# Altium schematic sheet wlpkt1_cpu.SchDoc: Moduł mikrokontrolera
size A4; DocumentNumber: 3; SheetNumber: 3; SheetTotal: 5
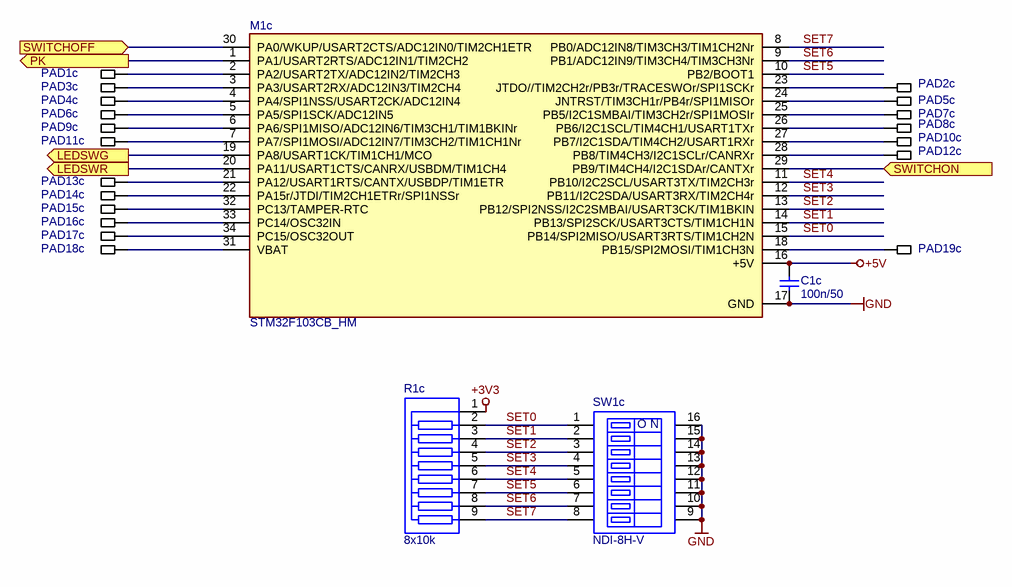
[diagram p0: wlpkt1_cpu.SchDoc]

## Parts
C1c  100n/50  [0805]
M1c  STM32F103CB_HM  [STM32F103CB_HM]
PAD1c  PAD0_6MM  [PAD0_6MM]  (value not drawn)  (no BOM)
PAD2c  PAD0_6MM  [PAD0_6MM]  (value not drawn)  (no BOM)
PAD3c  PAD0_6MM  [PAD0_6MM]  (value not drawn)  (no BOM)
PAD4c  PAD0_6MM  [PAD0_6MM]  (value not drawn)  (no BOM)
PAD5c  PAD0_6MM  [PAD0_6MM]  (value not drawn)  (no BOM)
PAD6c  PAD0_6MM  [PAD0_6MM]  (value not drawn)  (no BOM)
PAD7c  PAD0_6MM  [PAD0_6MM]  (value not drawn)  (no BOM)
PAD8c  PAD0_6MM  [PAD0_6MM]  (value not drawn)  (no BOM)
PAD9c  PAD0_6MM  [PAD0_6MM]  (value not drawn)  (no BOM)
PAD10c  PAD0_6MM  [PAD0_6MM]  (value not drawn)  (no BOM)
PAD11c  PAD0_6MM  [PAD0_6MM]  (value not drawn)  (no BOM)
PAD12c  PAD0_6MM  [PAD0_6MM]  (value not drawn)  (no BOM)
PAD13c  PAD0_6MM  [PAD0_6MM]  (value not drawn)  (no BOM)
PAD14c  PAD0_6MM  [PAD0_6MM]  (value not drawn)  (no BOM)
PAD15c  PAD0_6MM  [PAD0_6MM]  (value not drawn)  (no BOM)
PAD16c  PAD0_6MM  [PAD0_6MM]  (value not drawn)  (no BOM)
PAD17c  PAD0_6MM  [PAD0_6MM]  (value not drawn)  (no BOM)
PAD18c  PAD0_6MM  [PAD0_6MM]  (value not drawn)  (no BOM)
PAD19c  PAD0_6MM  [PAD0_6MM]  (value not drawn)  (no BOM)
R1c  8x10k  [9SIP100]
SW1c  NDI-8H-V  [EAH108E]

## Ports
LEDSWG (out), LEDSWR (out), PK (out), SWITCHOFF (in), SWITCHON (in)

## Nets
+3V3: R1c.1
+5V: C1c.1 M1c.16(+5V)
GND: C1c.2 M1c.17(GND) SW1c.9 SW1c.10 SW1c.11 SW1c.12 SW1c.13 SW1c.14 SW1c.15 SW1c.16
LEDSWG: M1c.19(PA8/USART1CK/TIM1CH1/MCO) ; port LEDSWG
LEDSWR: M1c.20(PA11/USART1CTS/CANRX/USBDM/TIM1CH4) ; port LEDSWR
PK: M1c.1(PA1/USART2RTS/ADC12IN1/TIM2CH2) ; port PK
SET0: M1c.15(PB14/SPI2MISO/USART3RTS/TIM1CH2N) R1c.2(R8) SW1c.1
SET1: M1c.14(PB13/SPI2SCK/USART3CTS/TIM1CH1N) R1c.3(R7) SW1c.2
SET2: M1c.13(PB12/SPI2NSS/I2C2SMBAI/USART3CK/TIM1BKIN) R1c.4(R6) SW1c.3
SET3: M1c.12(PB11/I2C2SDA/USART3RX/TIM2CH4r) R1c.5(R5) SW1c.4
SET4: M1c.11(PB10/I2C2SCL/USART3TX/TIM2CH3r) R1c.6(R4) SW1c.5
SET5: M1c.10(PB2/BOOT1) R1c.7(R3) SW1c.6
SET6: M1c.9(PB1/ADC12IN9/TIM3CH4/TIM3CH3Nr) R1c.8(R2) SW1c.7
SET7: M1c.8(PB0/ADC12IN8/TIM3CH3/TIM1CH2Nr) R1c.9(R1) SW1c.8
SWITCHOFF: M1c.30(PA0/WKUP/USART2CTS/ADC12IN0/TIM2CH1ETR) ; port SWITCHOFF
SWITCHON: M1c.29(PB9/TIM4CH4/I2C1SDAr/CANTXr) ; port SWITCHON
NetM1c_2: M1c.2(PA2/USART2TX/ADC12IN2/TIM2CH3) PAD1c.1
NetM1c_3: M1c.3(PA3/USART2RX/ADC12IN3/TIM2CH4) PAD3c.1
NetM1c_4: M1c.4(PA4/SPI1NSS/USART2CK/ADC12IN4) PAD4c.1
NetM1c_5: M1c.5(PA5/SPI1SCK/ADC12IN5) PAD6c.1
NetM1c_6: M1c.6(PA6/SPI1MISO/ADC12IN6/TIM3CH1/TIM1BKINr) PAD9c.1
NetM1c_7: M1c.7(PA7/SPI1MOSI/ADC12IN7/TIM3CH2/TIM1CH1Nr) PAD11c.1
NetM1c_18: M1c.18(PB15/SPI2MOSI/TIM1CH3N) PAD19c.1
NetM1c_21: M1c.21(PA12/USART1RTS/CANTX/USBDP/TIM1ETR) PAD13c.1
NetM1c_22: M1c.22(PA15r/JTDI/TIM2CH1ETRr/SPI1NSSr) PAD14c.1
NetM1c_23: M1c.23(JTDO//TIM2CH2r/PB3r/TRACESWOr/SPI1SCKr) PAD2c.1
NetM1c_24: M1c.24(JNTRST/TIM3CH1r/PB4r/SPI1MISOr) PAD5c.1
NetM1c_25: M1c.25(PB5/I2C1SMBAI/TIM3CH2r/SPI1MOSIr) PAD7c.1
NetM1c_26: M1c.26(PB6/I2C1SCL/TIM4CH1/USART1TXr) PAD8c.1
NetM1c_27: M1c.27(PB7/I2C1SDA/TIM4CH2/USART1RXr) PAD10c.1
NetM1c_28: M1c.28(PB8/TIM4CH3/I2C1SCLr/CANRXr) PAD12c.1
NetM1c_31: M1c.31(VBAT) PAD18c.1
NetM1c_32: M1c.32(PC13/TAMPER-RTC) PAD15c.1
NetM1c_33: M1c.33(PC14/OSC32IN) PAD16c.1
NetM1c_34: M1c.34(PC15/OSC32OUT) PAD17c.1

## Notes on the sheet
- Jeżeli nie wskazano inaczej, tolerancja rezystorów wynosi 1%
- Nazwa modułu (skrót)
- Słowna nazwa modułu
- Rozmiar arkusza
- A4
- Projektował
- Rysował
- Podpis
- Data:
- Ark.
- z
- Wer.
- (in symbol Elm19) O N

## Library data of the parts
C1c = CAP7: Kod: CAP7; ID: 7; Descript: Kondensator: ceramiczny; MLCC; 100nF; 50V; X7R; ±10%; SMD; 0805; Reference5: CL21B104KBCNNNC; Value: 100n/50; Price5: 0; DateOfPrice5: 2010-01-01; Supplier5: tme.pl; Manufacturer5: Samsung; Typ5: CL21B104KBCNNNC
M1c = Mod98: Kod: Mod98; ID: 98; Descript: Moduł STM32F103CB_HM; Value: STM32F103CB_HM; Price5: 100; DateOfPrice5: 2020-12-20; Supplier5: mlach; Reference5: STM32F103CB_HM; Manufacturer5: mlach; Typ5: STM32F103CB_HM
PAD1c PAD2c PAD3c PAD4c PAD5c PAD6c PAD7c PAD8c PAD9c PAD10c PAD11c PAD12c PAD13c PAD14c PAD15c PAD16c PAD17c PAD18c PAD19c = NOB4: Kod: NOB4; ID: 4; Descript: bd; Value: PAD0_6MM
R1c = Res285: Kod: Res285; ID: 285; Descript: Drabinka rezystorowa: X; 10kom; Il.rezystorów: 8; THT; 0,125W; ±2%; Reference5: DR10K-8/9; Typ5: bd; Value: 8x10k; Price5: 0,5; DateOfPrice5: 2020-12-28; Supplier5: tme; Manufacturer5: bd
SW1c = Elm19: Kod: Elm19; ID: 19; Descript: Przełącznik: DIP-SWITCH; Ilość sekcji:8; ON-OFF; 0,1A/24VDC; 500V; Value: NDI-8H-V; Price5: 4; DateOfPrice5: 2010-01-01; Supplier5: tme.pl; Reference5: EAH108E; Manufacturer5: Diptronics; Typ5: NDI-8H-V